# EAGLE design light (EAGLE 7.5.0)
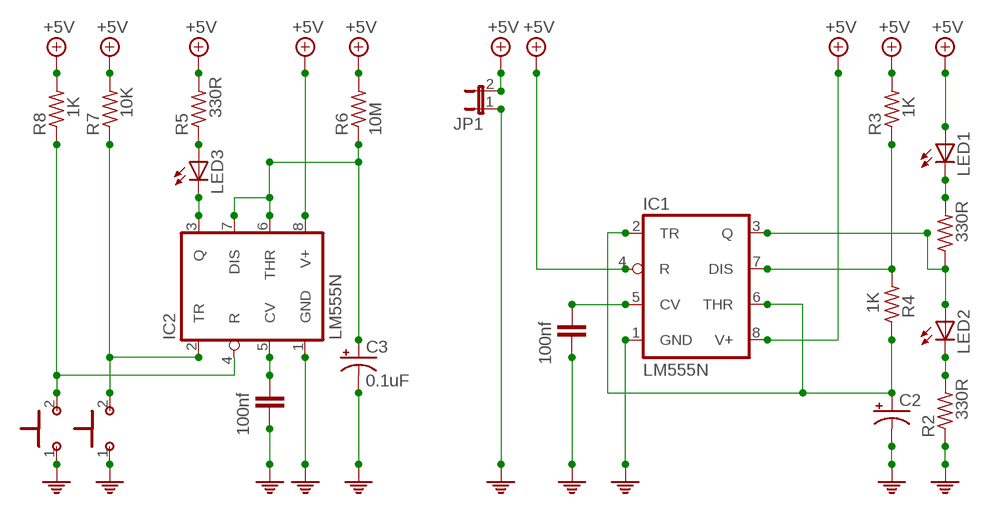
[diagram p0: schematic, sheet 1]

## Parts
C1  100nf  C-EU050-025X075  [C050-025X075]
C2  CPOL-USE5-9VAXIAL  [E5R]
C3  0.1uF  CPOL-USE5-9VAXIAL  [E5R]
C4  100nf  C-EU050-025X075  [C050-025X075]
IC1  LM555N  [DIL08]
IC2  LM555N  [DIL08]
JP1  JP1E  [JP1]
LED1  LED5MM  [LED5MM]
LED2  LED5MM  [LED5MM]
LED3  LED5MM  [LED5MM]
R1  330R  R-US_0207/10  [0207/10]
R2  330R  R-US_0207/10  [0207/10]
R3  1K  R-US_0207/10  [0207/10]
R4  1K  R-US_0207/10  [0207/10]
R5  330R  R-US_0207/10  [0207/10]
R6  10M  R-US_0207/10  [0207/10]
R7  10K  R-US_0207/10  [0207/10]
R8  1K  R-US_0207/10  [0207/10]
U$1  PUSHBUTTON  [PUSHBUTTON]
U$2  PUSHBUTTON  [PUSHBUTTON]

## Nets
+5V: IC1.4(R) IC1.8(V+) IC2.8(V+) JP1.2 LED1.A R3.2 R5.2 R6.2 R7.2 R8.2
N$1: IC1.3(Q) LED2.A R1.1
N$2: C1.1 IC1.5(CV)
N$3: C2.+ IC1.2(TR) IC1.6(THR) R4.1
N$4: LED2.K(C) R2.2
N$5: IC1.7(DIS) R3.1 R4.2
N$6: LED1.K(C) R1.2
N$7: C4.1 IC2.5(CV)
N$8: IC2.3(Q) LED3.K(C)
N$9: LED3.A R5.1
N$10: C3.+ IC2.6(THR) IC2.7(DIS) R6.1
N$13: IC2.2(TR) R7.1 U$1.2
N$14: IC2.4(R) R8.1 U$2.2
PE: C1.2 C2.- C3.- C4.2 IC1.1(GND) IC2.1(GND) JP1.1 R2.1 U$1.1 U$2.1

## Library data of the parts
C1 C4 = rcl:C-EU: CAPACITOR, European symbol
C2 C3 = rcl:CPOL-US: POLARIZED CAPACITOR, American symbol
IC1 IC2 = linear:*555: TIMER
JP1 = jumper:JP1E: JUMPER
LED1-LED3 = led:LED: LED OSRAM: - CHIPLED LG R971, LG N971, LY N971, LG Q971, LY Q971, LO R971, LY R971 LH N974, LH R974 LS Q976, LO Q976, LY Q976 LO Q996 - Hyper CHIPLED LW Q18S LB Q993, LB Q99A, LB R99A - SideLED LS A670, LO A670, LY A670, LG A670, LP A670 LB A673, LV A673, LT A673, LW A673 LH A674 LY A675 LS A676, LA A676, LO A676, LY A676, LW A676 LS A679, LY A679, LG A679 - Hyper Micro SIDELED® LS Y876, LA Y876, LO Y876, LY Y876 LT Y87S - SmartLED LW L88C, LW L88S LB L89C, LB L89S, LG L890 LS L89K, LO L89K, LY L89K LS L896, LA L896, LO L896, LY L896 - TOPLED LS T670, LO T670, LY T670, LG T670, LP T670 LSG T670, LSP T670, LSY T670, LOP T670, LYG T670 LG T671, LOG T671, LSG T671 LB T673, LV T673, LT T673, LW T673 LH T674 LS T676, LA T676, LO T676, LY T676, LB T676, LH T676, LSB T676, LW T676 LB T67C, LV T67C, LT T67C, LS T67K, LO T67K, LY T67K, LW E67C LS E67B, LA E67B, LO E67B, LY E67B, LB E67C, LV E67C, LT E67C LW T67C LS T679, LY T679, LG T679 LS T770, LO T770, LY T770, LG T770, LP T770 LB T773, LV T773, LT T773, LW T773 LH T774 LS E675, LA E675, LY E675, LS T675 LS T776, LA T776, LO T776, LY T776, LB T776 LHGB T686 LT T68C, LB T68C - Hyper Mini TOPLED® LB M676 - Mini TOPLED Santana® LG M470 LS M47K, LO M47K, LY M47K Source: http://www.osram.convergy.de LUXEON: - LUMILED® LXK2-PW12-R00, LXK2-PW12-S00, LXK2-PW14-U00, LXK2-PW14-V00 LXK2-PM12-R00, LXK2-PM12-S00, LXK2-PM14-U00 LXK2-PE12-Q00, LXK2-PE12-R00, LXK2-PE12-S00, LXK2-PE14-T00, LXK2-PE14-U00 LXK2-PB12-K00, LXK2-PB12-L00, LXK2-PB12-M00, LXK2-PB14-N00, LXK2-PB14-P00, LXK2-PB14-Q00 LXK2-PR12-L00, LXK2-PR12-M00, LXK2-PR14-Q00, LXK2-PR14-R00 LXK2-PD12-Q00, LXK2-PD12-R00, LXK2-PD12-S00 LXK2-PH12-R00, LXK2-PH12-S00 LXK2-PL12-P00, LXK2-PL12-Q00, LXK2-PL12-R00 Source: www.luxeon.com KINGBRIGHT: KA-3528ASYC Source: www.kingbright.com
R1-R8 = rcl:R-US_: RESISTOR, American symbol
U$1 U$2 = TEJ4M1:PUSHBUTTON

## Board
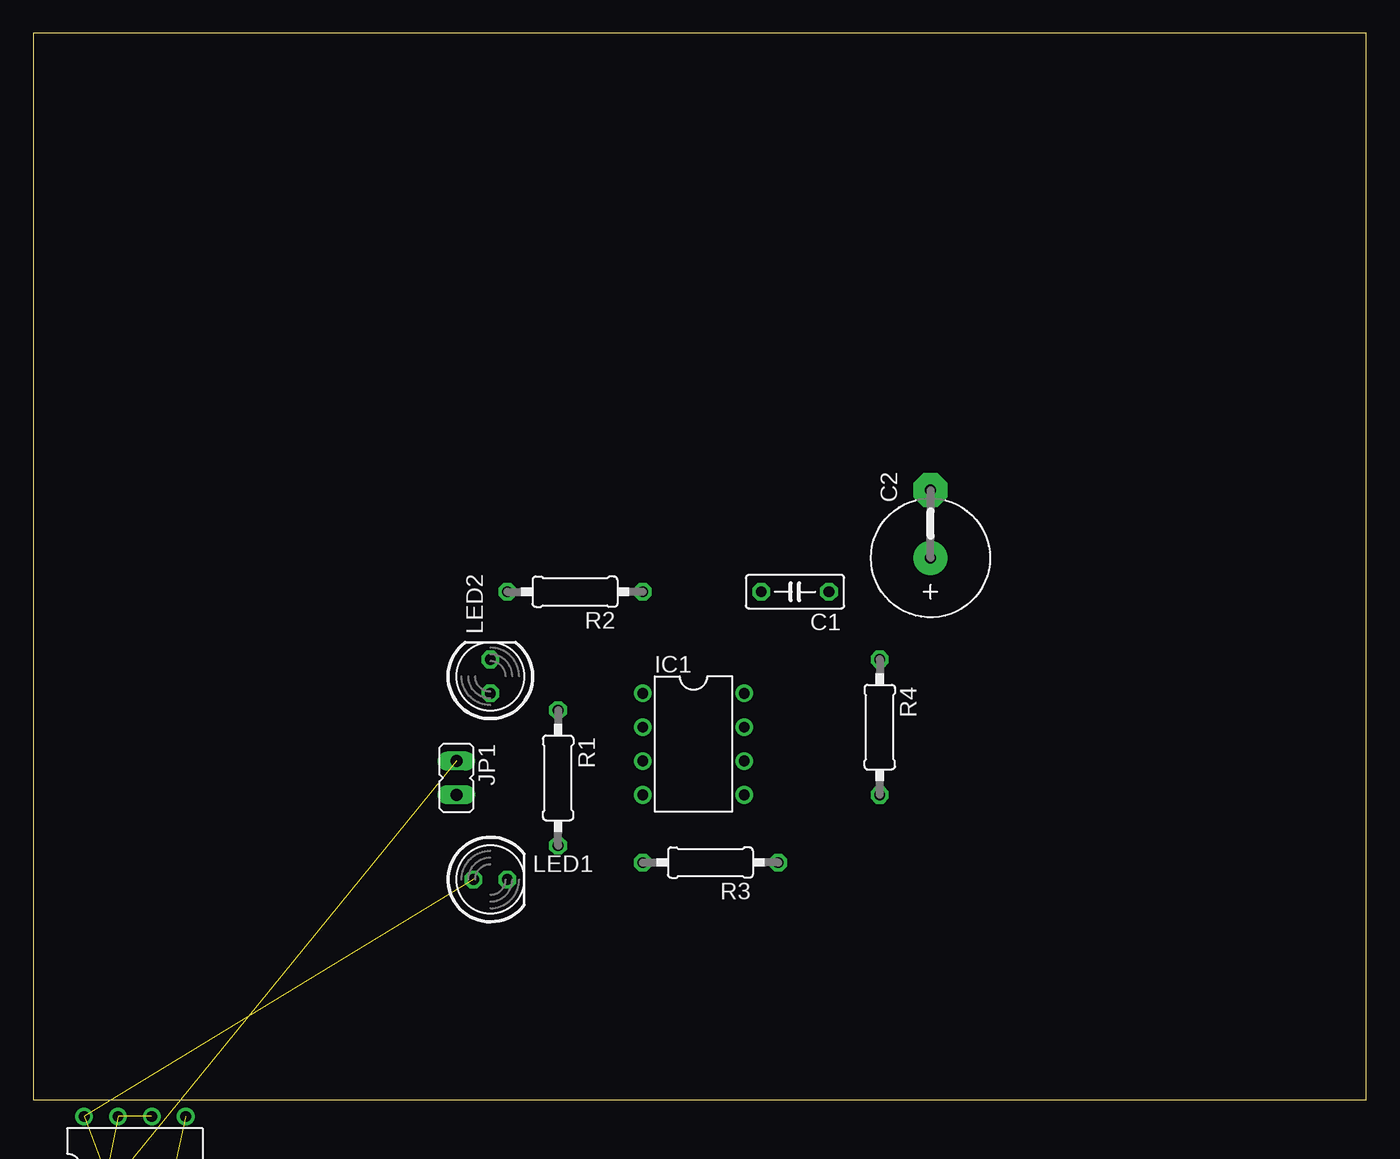
[diagram p1: board, top side]
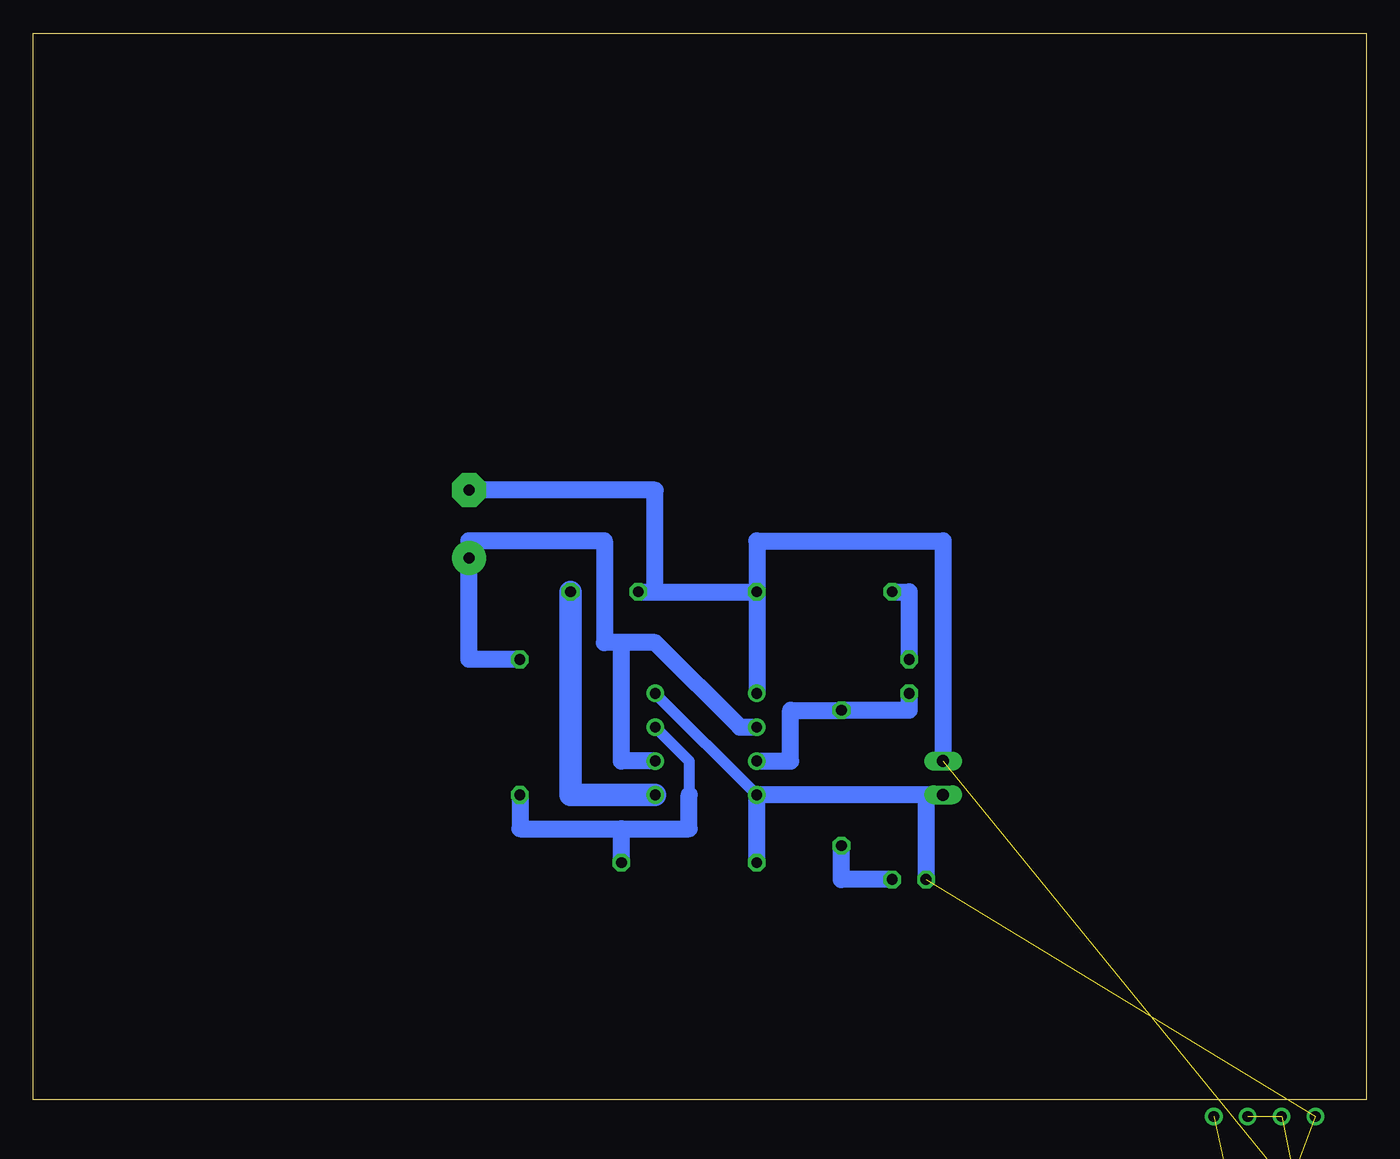
[diagram p2: board, bottom side, seen from below]

Size 100 x 80 mm. Coordinates in mm from the lower left corner, seen from the top.
Outline: 0,0 100,0 100,80 0,80 0,0
Copper layers (1*16): Top 0.035mm / dielectric 1.5mm / Bottom 0.035mm
Design rules "default": minimum track width 10mil, minimum drill 24mil, track to track 8mil, track to pad 8mil, pad to pad 8mil, via to via 8mil, smd to smd 8mil, copper to edge 40mil, drill to drill 8mil, minimum pad ring 10mil, minimum via ring 8mil, stop-mask expansion 4mil, vias tented up to drill 0mil, thermal gap 10mil

### Footprints (pad centres in the part's own frame; a part is rotated, then mirrored left to right if it is on the bottom)
C050-025X075 = drill 0.813 octagon: 1 -2.54,0; 2 2.54,0
E5R = drill 0.813 pad 2.54: + -2.54,0 | drill 0.813 pad 2.54 octagon: - 2.54,0
DIL08 = drill 0.813 pad 1.27: 1 -3.81,-3.81; 2 -1.27,-3.81; 3 1.27,-3.81; 4 3.81,-3.81; 5 3.81,3.81; 6 1.27,3.81; 7 -1.27,3.81; 8 -3.81,3.81
JP1 = drill 0.914 long: 1 0,-1.27; 2 0,1.27
LED5MM = drill 0.813 octagon: A -1.27,0; K 1.27,0
0207/10 = drill 0.813 octagon: 1 -5.08,0; 2 5.08,0
PUSHBUTTON = drill 0.5 pad 2.54 offset: 1 -2.54,0; 2 2.54,0

### Placement (x,y rotation side)
C1  57.15,38.1 180 top
C2  67.31,43.18 90 top
C3  7.62,-33.02 0 top  (outside the outline)
C4  5.08,-41.91 0 top  (outside the outline)
IC1  49.53,26.67 270 top
IC2  7.62,-5.08 0 top
JP1  31.75,24.13 180 top
LED1  34.29,16.51 0 top
LED2  34.29,31.75 90 top
LED3  3.81,-13.97 0 top  (outside the outline)
R1  39.37,24.13 270 top
R2  40.64,38.1 180 top
R3  50.8,17.78 180 top
R4  63.5,27.94 270 top
R5  6.35,-21.59 0 top  (outside the outline)
R6  6.35,-26.67 0 top  (outside the outline)
R7  6.35,-49.53 0 top  (outside the outline)
R8  6.35,-77.47 0 top  (outside the outline)
U$1  7.62,-57.15 0 top  (outside the outline)
U$2  7.62,-68.58 0 top  (outside the outline)

### Tracks (layer width: path | path; a pad name or v marks a point on that pad's centre or on a via)
+5V  (5 unrouted)
  Bottom 0.813: IC1.4 IC1.8
  Bottom 1.27: 33.02,22.86 IC1.4 R3.2 | JP1.2 33.02,22.86 | 33.02,22.86 LED1.A
N$1
  Bottom 1.27: IC1.3 43.18,25.4 43.18,29.21 R1.1 34.29,29.21 LED2.A
N$2
  Bottom 1.676: C1.1 59.69,22.86 IC1.5
N$3
  Bottom 1.27: R4.1 67.31,33.02 C2.+ 67.31,41.91 57.15,41.91 57.15,34.29 55.88,34.29 | 55.88,34.29 53.34,34.29 46.99,27.94 IC1.2 | IC1.6 55.88,25.4 55.88,34.29
N$4
  Bottom 1.27: R2.2 34.29,38.1 LED2.K
N$5
  Bottom 0.813: IC1.7 50.8,25.4 50.8,22.86
  Bottom 1.27: R4.2 63.5,20.32 55.88,20.32 | 55.88,20.32 50.8,20.32 50.8,22.86 | R3.1 55.88,20.32
N$6
  Bottom 1.27: LED1.K 39.37,16.51 R1.2
N$7  (1 unrouted)
N$8  (1 unrouted)
N$9  (1 unrouted)
N$10  (3 unrouted)
N$13  (2 unrouted)
N$14  (2 unrouted)
PE  (5 unrouted)
  Bottom 1.27: C2.- 53.34,45.72 53.34,38.1 C1.2 R2.1 | R2.1 IC1.1 | R2.1 45.72,41.91 31.75,41.91 JP1.1